# EAGLE design kartenmischer (EAGLE 9.6.0)
ABTEILUNG: Technische Informatik; BEARBEITER: Andrej Tica; DATUM: 12.11.2019; DOKUMENTART: Schaltplan; GEZ: TicA; ID: 4AHEL; SCHALTPLAN: Kartenmischer; STATUS: Prototyp; VER: 1.0
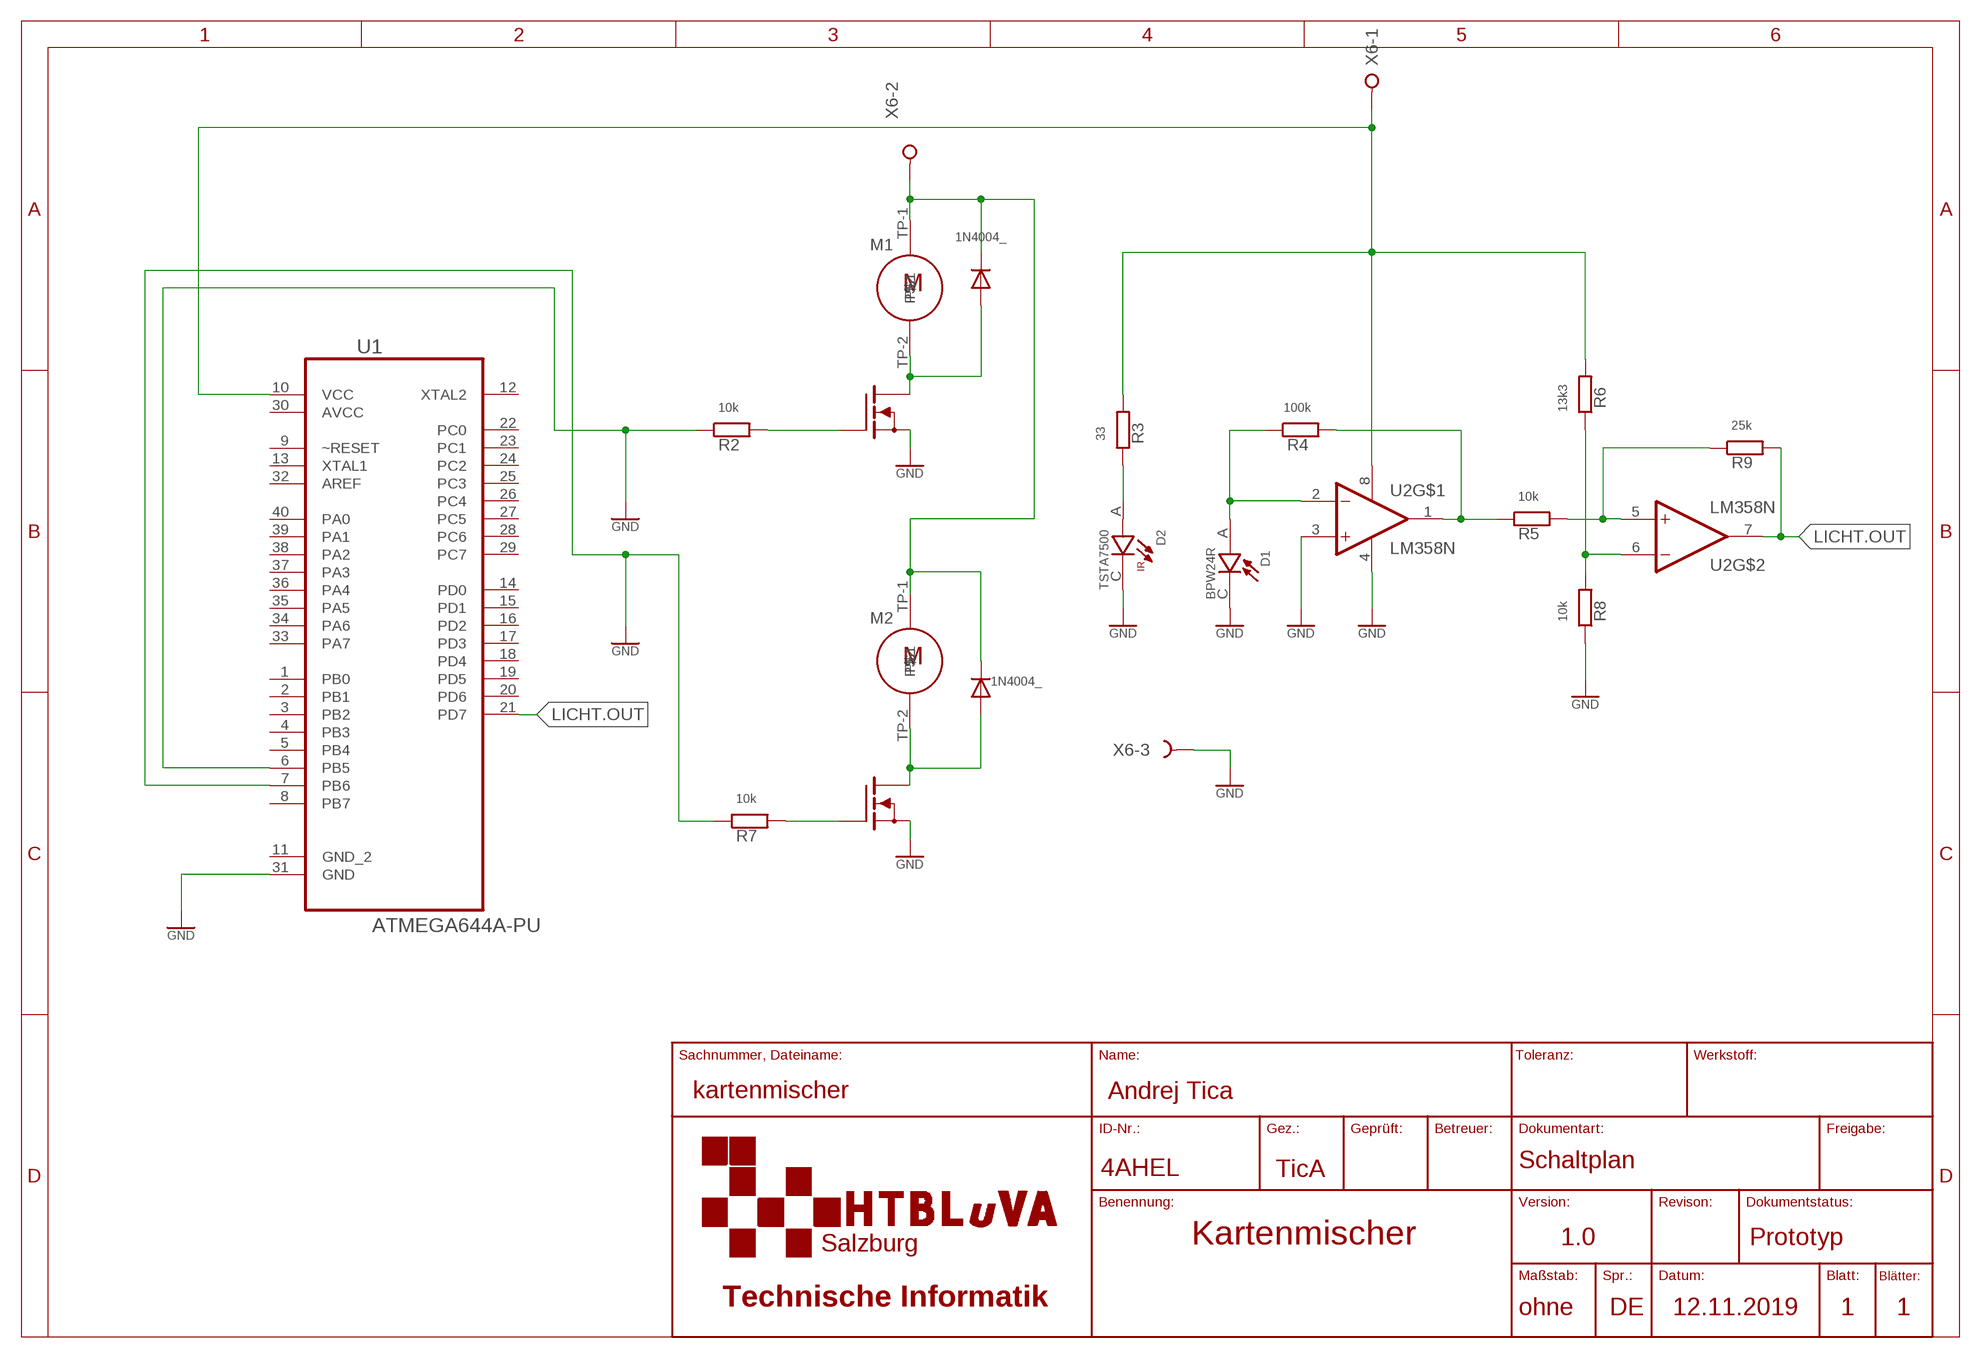
[diagram p0: schematic, sheet 1]

## Parts
D1  BPW24R  [TO127P565H840-2]
D2  TSTA7500  [TO127P565H745-2]
M1  MOTOR  [P2-38-17]
M2  MOTOR  [P2-38-17]
Q1  BUZ11  [TO220]
Q2  BUZ11  [TO220]
R2  10k  R-H_0204/7  [0204/7]
R3  33  R-H_0204/7  [0204/7]
R4  100k  R-H_0204/7  [0204/7]
R5  10k  R-H_0204/7  [0204/7]
R6  13k3  R-H_0204/7  [0204/7]
R7  10k  R-H_0204/7  [0204/7]
R8  10k  R-H_0204/7  [0204/7]
R9  25k  R-H_0204/7  [0204/7]
U1  ATMEGA644A-PU  [DIP254P1524X483-40]
U2  LM358N  [DIP762W46P254L960H508Q8]
V1  1N4004_  [DO41-10]
V2  1N4004_  [DO41-10]
X6  W237-3E  [W237-3E]

## Nets
GND: D1.C D2.C Q1.3(S) Q2.3(S) R2.1 R8.1 U1.6(PB5) U1.31(GND) U2.3(1IN+) X6.3
LICHT.OUT: U1.21(PD7)
N$1: Q2.1(G) R7.2
N$2: R7.1 U1.7(PB6) ; supply symbol labelled GND
N$3: Q1.1(G) R2.2
N$4: M2.TP-2 Q2.2(D) V2.A
N$5: U2.4(GND) ; supply symbol labelled GND
N$6: R3.2 R6.2 U1.10(VCC) U2.8(VCC) X6.1
N$7: D2.A R3.1
N$9: D1.A R4.1 U2.2(1IN-)
N$10: M1.TP-1 M2.TP-1 V1.C V2.C X6.2
N$11: M1.TP-2 Q1.2(D) V1.A
N$12: R4.2 R5.1 U2.1(1OUT)
N$14: R5.2 R9.1 U2.5(2IN+)
N$16: R9.2 U2.7(2OUT)
N$17: R6.1 R8.2 U2.6(2IN-)
Unconnected: U1.1(PB0) U1.2(PB1) U1.3(PB2) U1.4(PB3) U1.5(PB4) U1.8(PB7) U1.9(~RESET) U1.11(GND_2) U1.12(XTAL2) U1.13(XTAL1) U1.14(PD0) U1.15(PD1) U1.16(PD2) U1.17(PD3) U1.18(PD4) U1.19(PD5) U1.20(PD6) U1.22(PC0) U1.23(PC1) U1.24(PC2) U1.25(PC3) U1.26(PC4) U1.27(PC5) U1.28(PC6) U1.29(PC7) U1.32(AREF) U1.33(PA7) U1.34(PA6) U1.35(PA5) U1.36(PA4) U1.37(PA3) U1.38(PA2) U1.39(PA1) U1.40(PA0)

## Power pins joined to a net without a drawn wire
AVCC: U1.30(AVCC)

## Library data of the parts
D1 = BPW24R:BPW24R; AVAILABILITY: Unavailable; DESCRIPTION: Photodiode 900nm 24° Radial, Lensed Metal Can, TO-46-2; MF: Vishay Semiconductor; MP: BPW24R; PACKAGE: Radial Vishay; PRICE: None
D2 = TSTA7500:TSTA7500: LED IrLED 875nm 2-Pin TO-18 Bulk; AVAILABILITY: Unavailable; DESCRIPTION: Infrared Emitter 875nm 6mW/sr Circular Top Mount 2-Pin TO-18 Bulk; MF: Vishay; MP: TSTA7500; PACKAGE: TO-18-2 Vishay; PRICE: None
M1 M2 = con_TicA:MOTOR: DC Brush Motor
Q1 Q2 = BUZ11:BUZ11: N-Channel Enhancement MOSFET; AVAILABILITY: Unavailable; DESCRIPTION: To220 Nch Mos 50V .04R; MF: ON Semiconductor; MP: BUZ11; PACKAGE: TO-220-3 Vishay; PRICE: None
R2-R9 = rcl_TicA:R-H_: RESISTOR, European symbol
U1 = ATMEGA644A-PU:ATMEGA644A-PU: 8-bit Microcontroller with In-System Programmable Flash; AVAILABILITY: Unavailable; DESCRIPTION: AVR AVR® ATmega Microcontroller IC 8-Bit 20MHz 64KB _32K x 16_ FLASH 40-PDIP; MF: Microchip; MP: ATMEGA644A-PU; PACKAGE: DIP-40 Microchip; PRICE: None
U2 = LM358N:LM358N: IC OPAMP GP 2 CIRCUIT 8DIP; AVAILABILITY: Unavailable; DESCRIPTION: General Purpose Amplifier 2 Circuit 8-DIP; MF: ON Semiconductor; MP: LM358N; PACKAGE: DIP-8 Intersil; PRICE: None
V1 V2 = diode_TicA:1N4004_: DIODE general purpose rectifier, 1 A
X6 = con-wago-508:W237-3E: WAGO SREW CLAMP; OC_FARNELL: unknown; OC_NEWARK: unknown

## Board
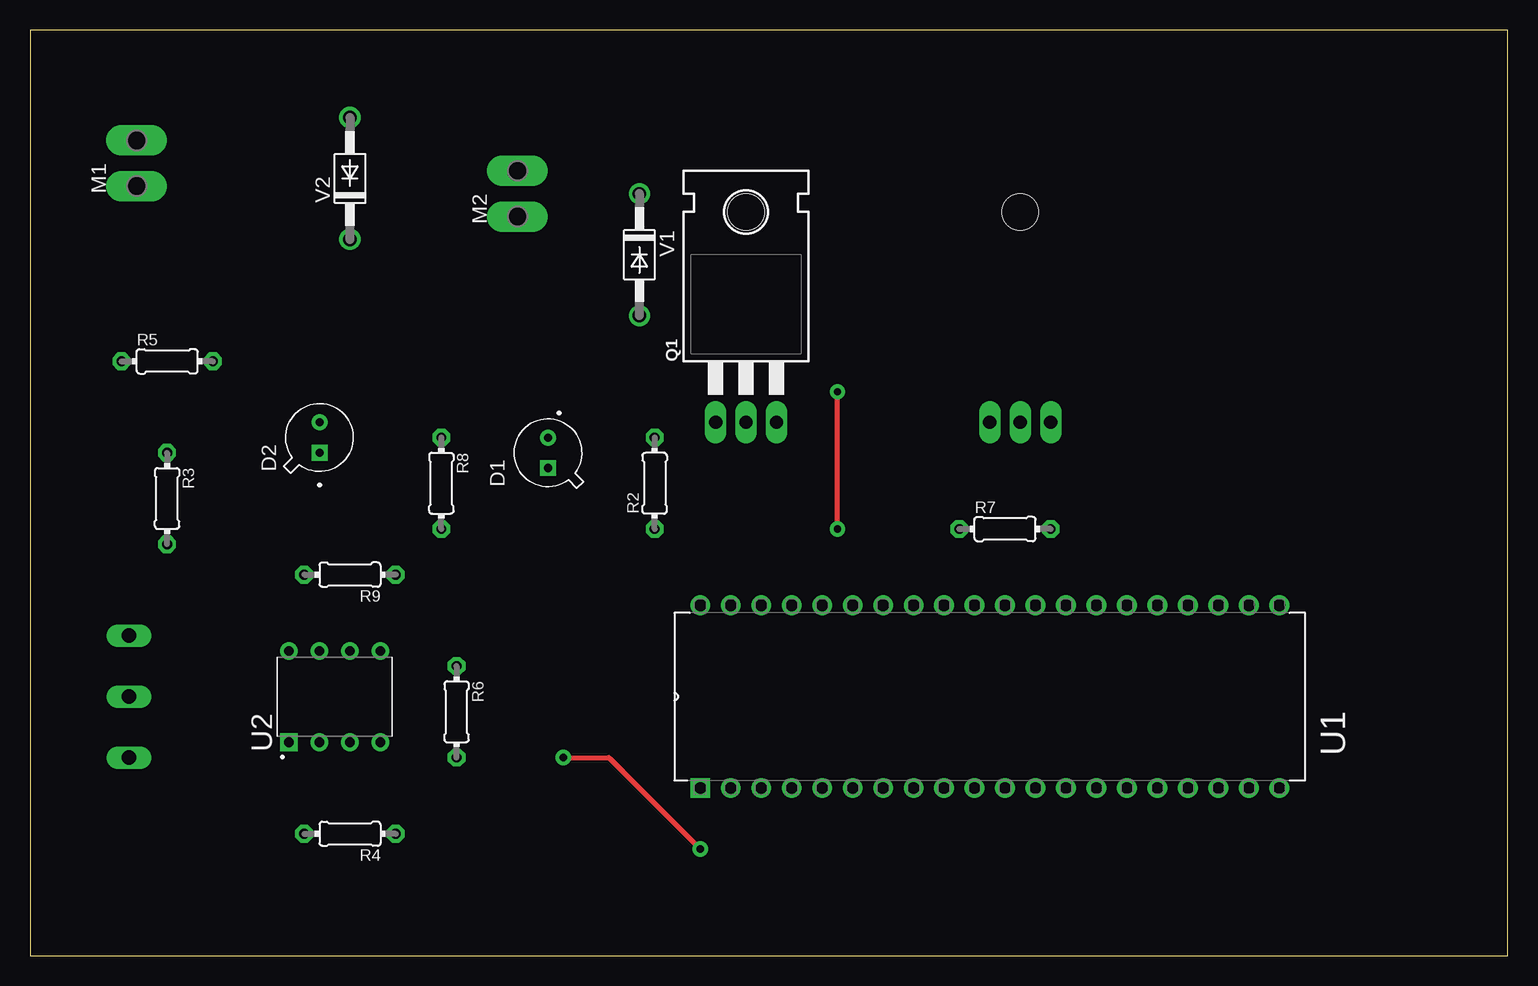
[diagram p1: board, top side]
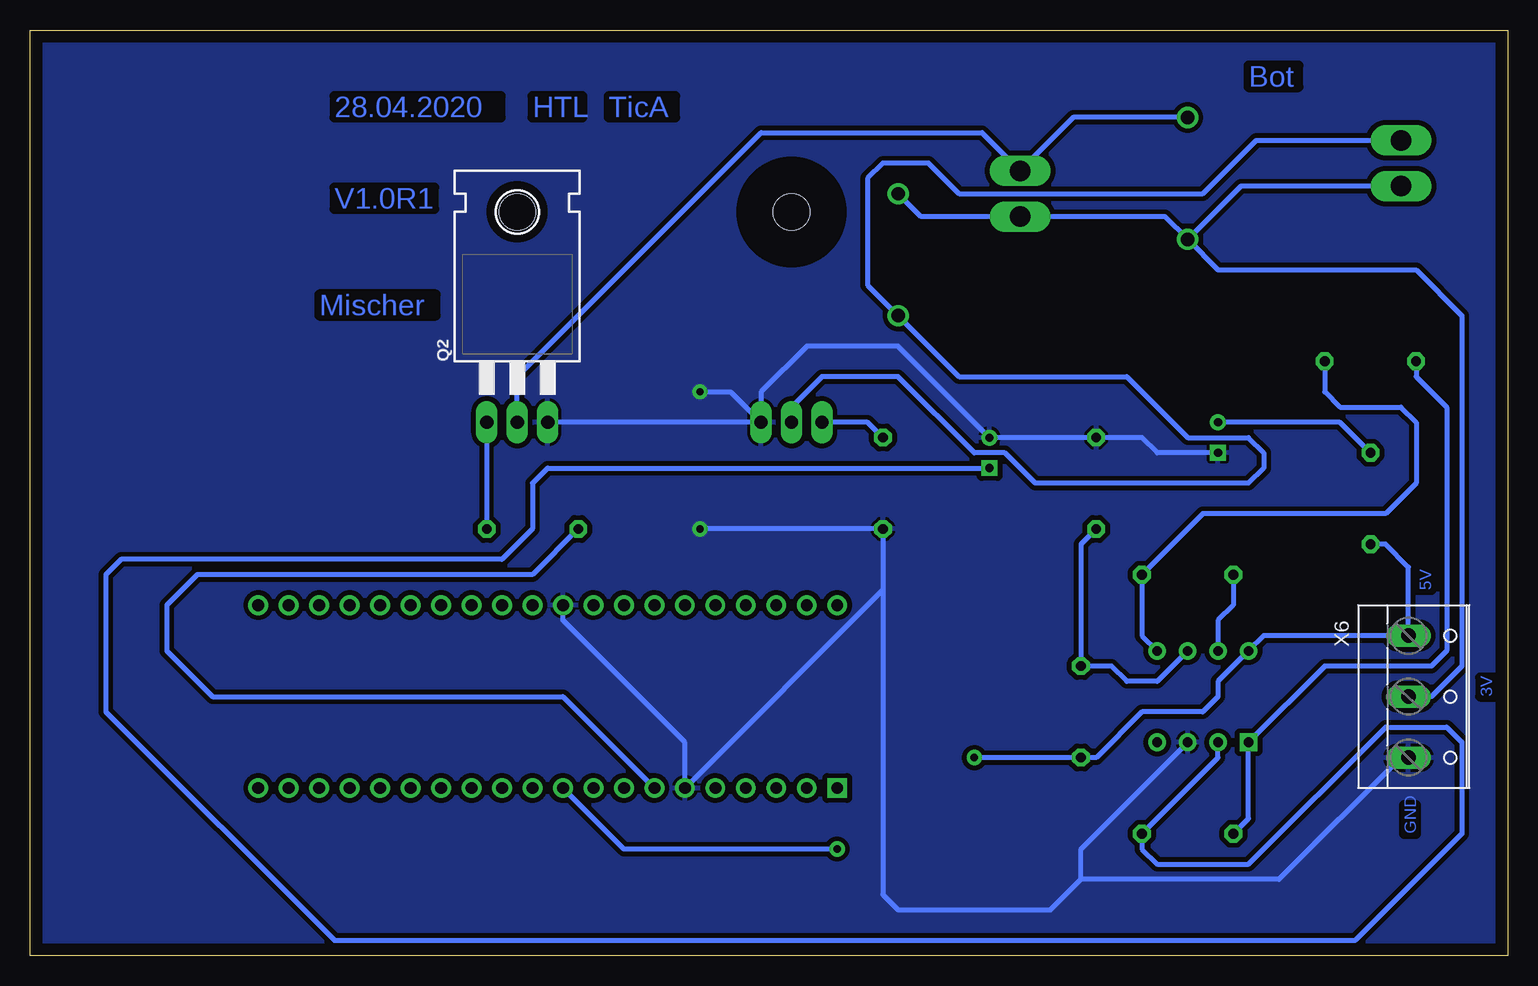
[diagram p2: board, bottom side, seen from below]

Size 123.17 x 77.14 mm. Coordinates in mm from the lower left corner, seen from the top.
Outline: 0,0 123.17,0 123.17,77.14 0,77.14 0,0
Copper layers (1*16): Top 0.035mm / dielectric 1.5mm / Bottom 0.035mm
Design rules "HTL": minimum track width 16mil, minimum drill 24mil, track to track 8mil, track to pad 8mil, pad to pad 8mil, via to via 8mil, smd to smd 8mil, copper to edge 40mil, drill to drill 8mil, minimum pad ring 13mil, minimum via ring 13mil, stop-mask expansion 4mil, vias tented up to drill 0mil, thermal gap 10mil

### Footprints (pad centres in the part's own frame; a part is rotated, then mirrored left to right if it is on the bottom)
TO127P565H840-2 = drill 0.67 pad 1.07 square: A -1.27,0 | drill 0.67 pad 1.07: C 1.27,0
TO127P565H745-2 = drill 0.67 pad 1.07: A 1.27,0 | drill 0.67 pad 1.07 square: C -1.27,0
P2-38-17 = drill 1.702 pad 2.121 long: TP-1 -1.905,0; TP-2 1.905,0
TO220 = drill 1.118 long: 1 -2.54,-6.35; 2 0,-6.35; 3 2.54,-6.35 | hole 3.048: 0,11.176
0204/7 = drill 0.813 octagon: 1 -3.81,0; 2 3.81,0
DIP254P1524X483-40 = drill 0.991 square: 1 -15.24,48.26 | drill 0.991: 2 -15.24,45.72; 3 -15.24,43.18; 4 -15.24,40.64; 5 -15.24,38.1; 6 -15.24,35.56; 7 -15.24,33.02; 8 -15.24,30.48; 9 -15.24,27.94; 10 -15.24,25.4; 11 -15.24,22.86; 12 -15.24,20.32; 13 -15.24,17.78; 14 -15.24,15.24; 15 -15.24,12.7; 16 -15.24,10.16; 17 -15.24,7.62; 18 -15.24,5.08; 19 -15.24,2.54; 20 -15.24,0; 21 0,0; 22 0,2.54; 23 0,5.08; 24 0,7.62; 25 0,10.16; 26 0,12.7; 27 0,15.24; 28 0,17.78; 29 0,20.32; 30 0,22.86; 31 0,25.4; 32 0,27.94; 33 0,30.48; 34 0,33.02; 35 0,35.56; 36 0,38.1; 37 0,40.64; 38 0,43.18; 39 0,45.72; 40 0,48.26
DIP762W46P254L960H508Q8 = drill 0.81 pad 1.22 square: 1 -3.81,3.81 | drill 0.81 pad 1.22: 2 -3.81,1.27; 3 -3.81,-1.27; 4 -3.81,-3.81; 5 3.81,-3.81; 6 3.81,-1.27; 7 3.81,1.27; 8 3.81,3.81
DO41-10 = drill 1.1: A 5.08,0; C -5.08,0
W237-3E = drill 1.194 long: 1 -5.08,-0.635; 2 0,-0.635; 3 5.08,-0.635

### Placement (x,y rotation side)
D1  43.18,41.91 90 top
D2  24.13,43.18 90 top
M1  8.89,66.04 90 top
M2  40.64,63.5 90 top
Q1  59.69,50.8 0 top
Q2  82.55,50.8 0 bottom
R2  52.07,39.37 90 top
R3  11.43,38.1 270 top
R4  26.67,10.16 180 top
R5  11.43,49.53 0 top
R6  35.56,20.32 270 top
R7  81.28,35.56 0 top
R8  34.29,39.37 270 top
R9  26.67,31.75 180 top
U1  104.14,29.21 90 top
U2  25.4,21.59 90 top
V1  50.8,58.42 270 top
V2  26.67,64.77 90 top
X6  7.62,21.59 270 bottom

### Tracks (layer width: path | path; a pad name or v marks a point on that pad's centre or on a via)
GND  (via drill 0.61 pad 0.6)
  Top 0.406: v67.31,35.56 v67.31,46.99
  Bottom 0.406: D2.C 29.21,41.91 30.48,43.18 R8.1 D1.C 50.8,50.8 58.42,50.8 62.23,46.99 Q1.3 | Q1.3 Q2.3 | X6.3 8.89,16.51 19.05,6.35 35.56,6.35 | 35.56,6.35 35.56,8.89 U2.3 | U1.31 78.74,27.94 68.58,17.78 U1.6 52.07,30.48 | 52.07,30.48 R2.1 v67.31,35.56 | 35.56,6.35 38.1,3.81 50.8,3.81 52.07,5.08 52.07,30.48 | v67.31,46.99 64.77,46.99 Q1.3
  pour Bottom (isolate 0.406): 0,0 123.19,0 123.19,77.47 0,77.47
N$1
  Bottom 0.406: Q2.1 R7.2
N$2
  Bottom 0.406: R7.1 81.28,31.75 109.22,31.75 111.76,29.21 111.76,25.4 107.95,21.59 78.74,21.59 U1.7
N$3
  Bottom 0.406: R2.2 53.34,44.45 Q1.1
N$4
  Bottom 0.406: Q2.2 82.55,48.26 64.77,66.04 64.44,66.37 62.23,68.58 43.81,68.58 M2.TP-2 36.2,69.85 V2.A
N$6  (via drill 0.61)
  Top 0.406: v44.45,16.51 48.26,16.51 v55.88,8.89
  Bottom 0.406: R3.2 10.16,34.29 8.26,32.38 X6.1 20.32,26.67 U2.8 24.13,22.86 24.13,21.59 25.4,20.32 30.48,20.32 34.29,16.51 R6.2 v44.45,16.51 | v55.88,8.89 73.66,8.89 U1.10
N$7
  Bottom 0.406: R3.1 13.97,44.45 D2.A
N$9
  Bottom 0.406: U2.2 24.13,16.51 R4.1 30.48,8.89 29.21,7.62 21.59,7.62 10.16,19.05 5.08,19.05 3.81,17.78 3.81,10.16 12.7,1.27 97.79,1.27 116.84,20.32 116.84,31.75 115.57,33.02 83.82,33.02 81.28,35.56 81.28,39.37 80.01,40.64 D1.A
N$10
  Bottom 0.406: V2.C 28.57,61.59 M2.TP-1 48.9,61.59 V1.C | V2.C 24.13,57.15 7.62,57.15 3.81,53.34 3.81,24.13 6.35,21.59 X6.2 | M1.TP-1 22.23,64.14 V2.C
N$11
  Bottom 0.406: Q1.2 59.69,45.72 57.15,48.26 50.8,48.26 44.45,41.91 41.91,41.91 39.37,39.37 21.59,39.37 20.32,40.64 20.32,41.91 21.59,43.18 26.67,43.18 31.75,48.26 45.72,48.26 V1.A 53.34,55.88 53.34,64.77 52.07,66.04 48.26,66.04 45.72,63.5 25.4,63.5 20.95,67.94 M1.TP-2
N$12
  Bottom 0.406: R5.1 7.62,48.26 5.08,45.72 5.08,25.4 6.35,24.13 15.24,24.13 U2.1 21.59,11.43 R4.2
N$14
  Bottom 0.406: R5.2 15.24,46.99 13.97,45.72 8.89,45.72 7.62,44.45 7.62,39.37 10.16,36.83 25.4,36.83 R9.1 30.48,26.67 U2.5
N$16
  Bottom 0.406: R9.2 22.86,29.21 24.13,27.94 U2.7
N$17
  Bottom 0.406: U2.6 29.21,22.86 31.75,22.86 33.02,24.13 R6.1 35.56,34.29 R8.2

### Text on the board
Bottom: Bot | TicA | HTL | 28.04.2020 | V1.0R1 | Mischer | 5V | 3V | GND